# Altium project Ultrasound Smart Probe_Ver2.PrjPcb (part 4 of 9)

## Sheet LVPS_FX3_Supply.SchDoc: FX3 Power Supply
size 431 x 279 mm; Date: Not shown in title block; ApprovedBy: Not shown in title block; CheckedBy: Not shown in title block; Author: Not shown in title block; CompanyName: Not shown in title block; DrawnBy: Abhishek Vishwa; Engineer: Not shown in title block; Organization: Not shown in title block; Address1: Not shown in title block; Address2: Not shown in title block; Address3: Not shown in title block; Address4: Not shown in title block; DocumentNumber: 1; Revision: Use project parameter SCH_Rev; SheetNumber: 4; SheetTotal: 12; PageSetup: Record=PageOptions|CenterHorizontal=True|CenterVertical=True|PrintScale=1.00|XCorrection=1.00|YCorrection=1.00|PrintKind=0|BorderSize=5000000|LeftOffset=0|BottomOffset=0|Orientation=2|PaperLength=1000|PaperWidth=1000|Scale=100|PaperSource=15|PrintQuality=600|MediaType=1|DitherType=10|PaperKind=Letter|PrintScaleMode=1; CurrentTime: Not shown in title block; CurrentDate: Not shown in title block; Time: Not shown in title block; DocumentFullPathAndName: Not shown in title block; DocumentName: Not shown in title block; ModifiedDate: Not shown in title block; ImagePath: Not shown in title block
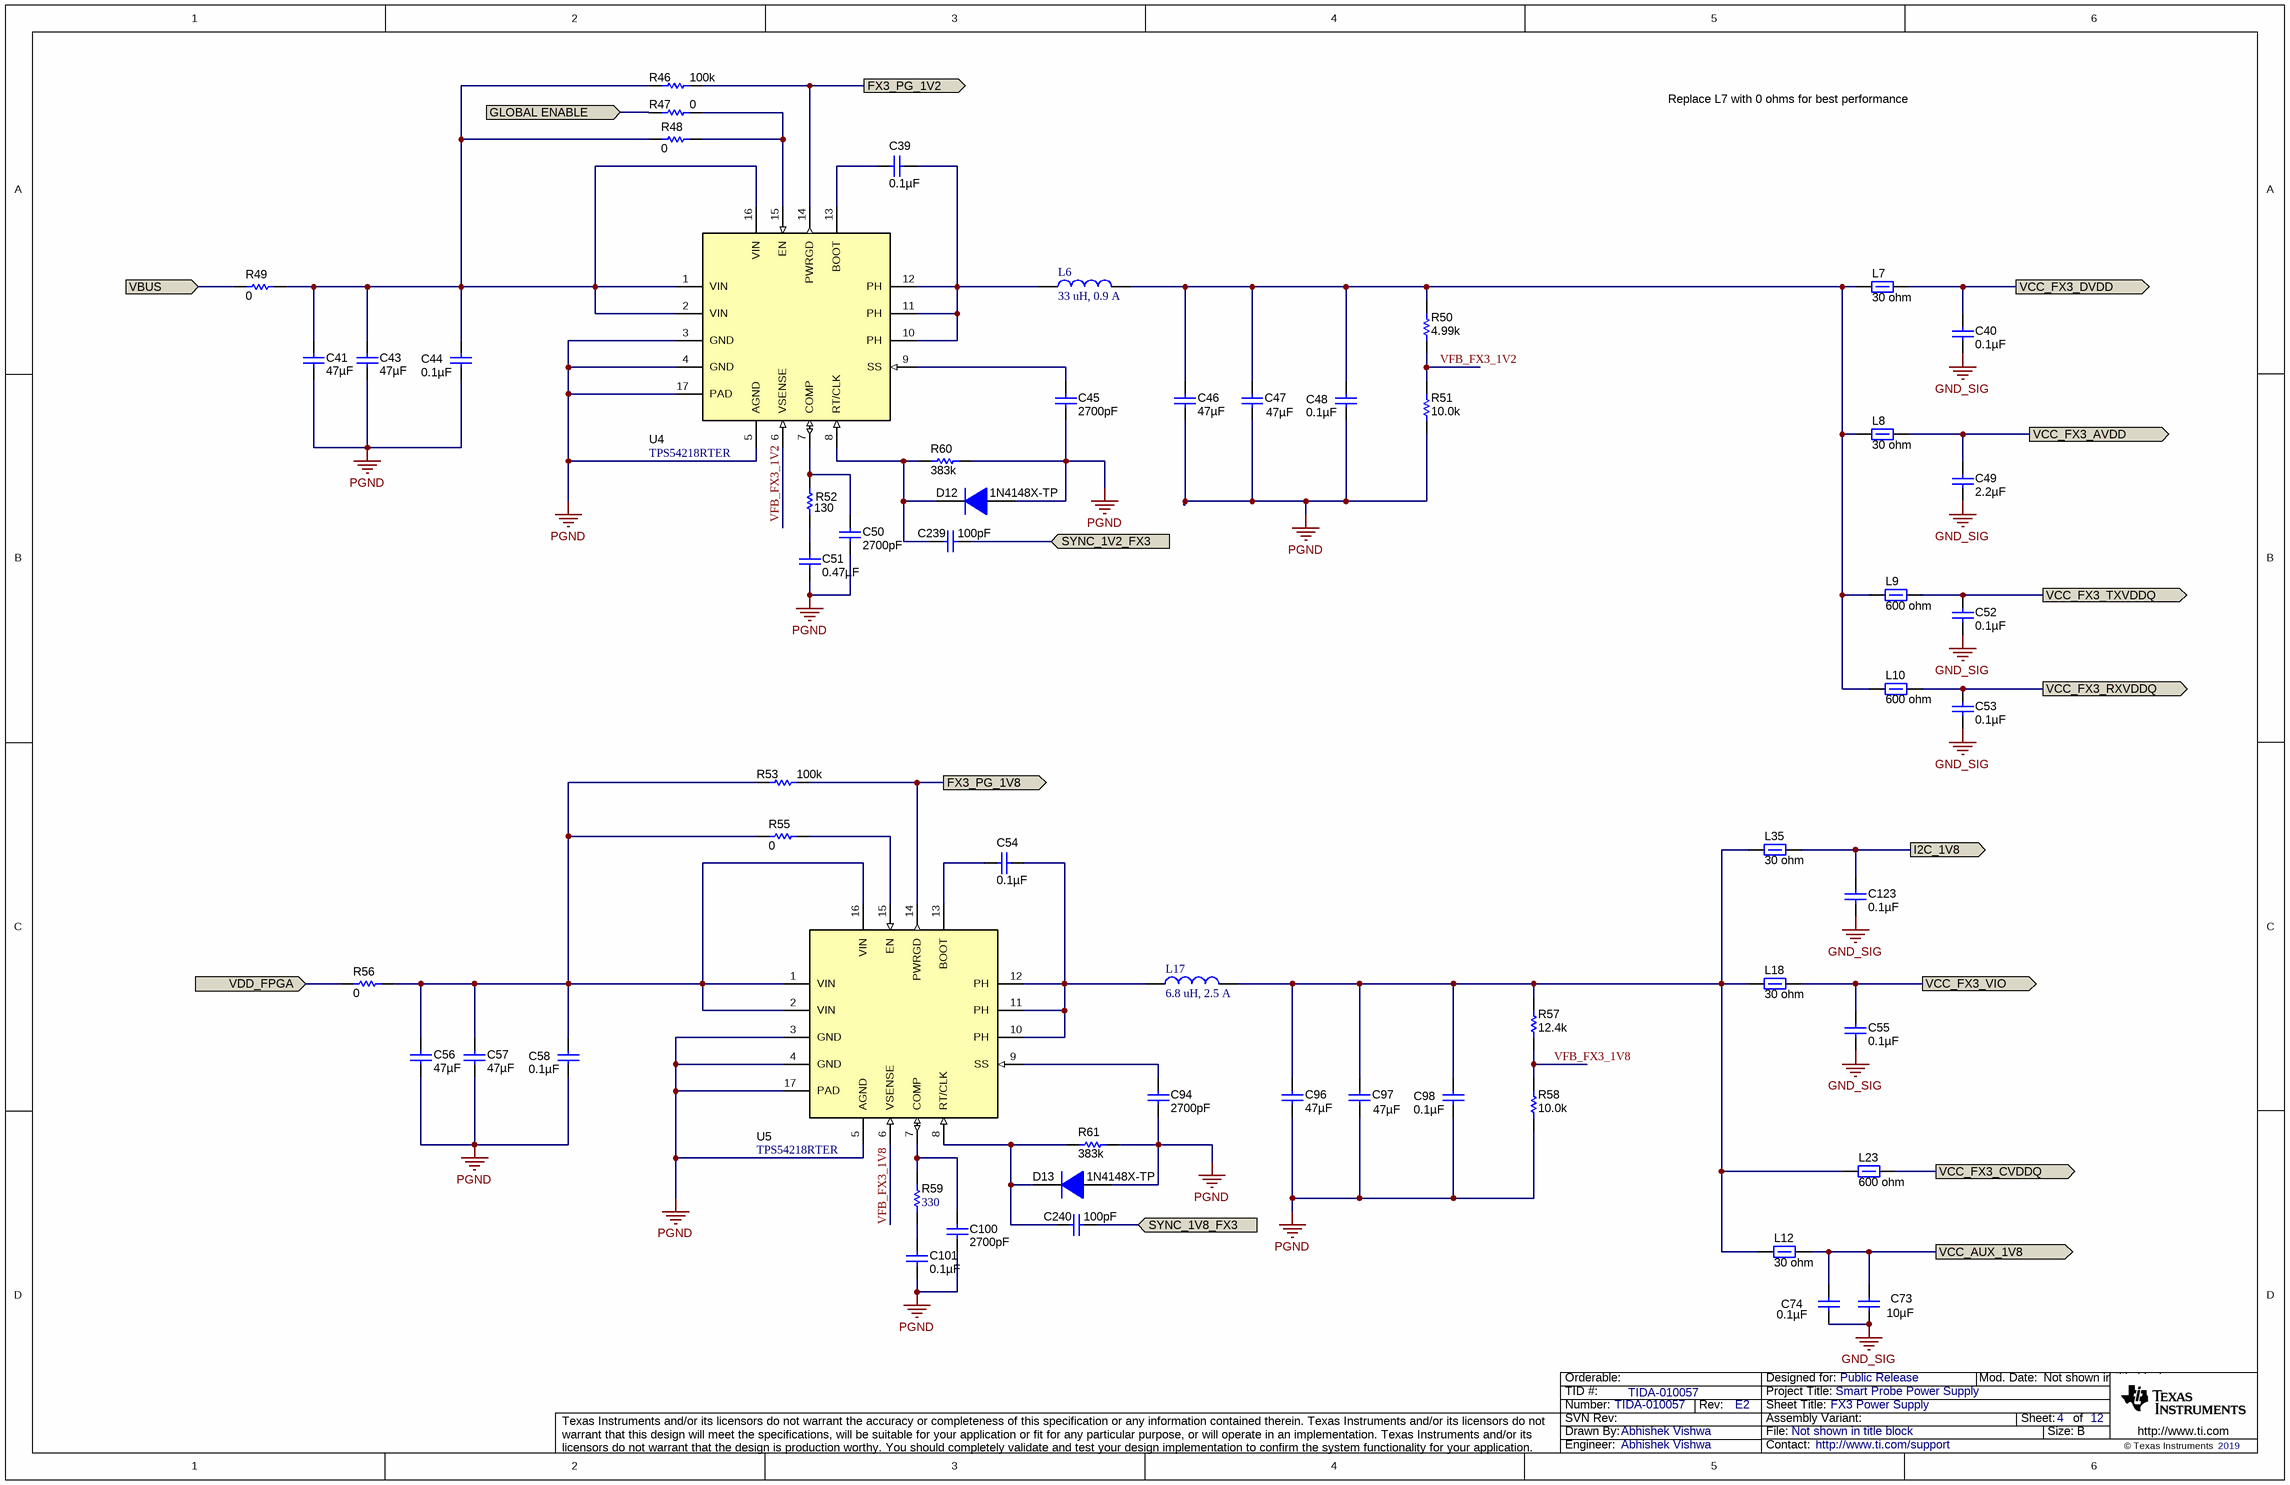
[diagram p3: LVPS_FX3_Supply.SchDoc]

### Parts
C39  ValueDisplayed: 0.1µF  [0603]  (hidden comment: 885012206095)
C40  ValueDisplayed: 0.1µF  [0402]  (hidden comment: GRM155R61E104KA87D)
C41  ValueDisplayed: 47µF  [0805_HV]  (hidden comment: GRM219R60J476ME44D)
C43  ValueDisplayed: 47µF  [0805_HV]  (hidden comment: GRM219R60J476ME44D)
C44  ValueDisplayed: 0.1µF  [0603]  (hidden comment: 885012206095)
C45  ValueDisplayed: 2700pF  [0402]  (hidden comment: CL05B272KB5NNNC)
C46  ValueDisplayed: 47µF  [0603]  (hidden comment: GRM188R60J476ME15D)
C47  ValueDisplayed: 47µF  [0603]  (hidden comment: GRM188R60J476ME15D)
C48  ValueDisplayed: 0.1µF  [0603]  (hidden comment: 885012206095)
C49  ValueDisplayed: 2.2µF  [0402_070]  (hidden comment: CL05A225MA5NUNC)
C50  ValueDisplayed: 2700pF  [0402]  (hidden comment: CL05B272KB5NNNC)
C51  ValueDisplayed: 0.47µF  [0402]  (hidden comment: CL05A474KP5NNNC)
C52  ValueDisplayed: 0.1µF  [0402]  (hidden comment: GRM155R61E104KA87D)
C53  ValueDisplayed: 0.1µF  [0402]  (hidden comment: GRM155R61E104KA87D)
C54  ValueDisplayed: 0.1µF  [0603]  (hidden comment: 885012206095)
C55  ValueDisplayed: 0.1µF  [0402]  (hidden comment: GRM155R61E104KA87D)
C56  ValueDisplayed: 47µF  [0805_HV]  (hidden comment: GRM219R60J476ME44D)
C57  ValueDisplayed: 47µF  [0805_HV]  (hidden comment: GRM219R60J476ME44D)
C58  ValueDisplayed: 0.1µF  [0603]  (hidden comment: 885012206095)
C73  ValueDisplayed: 10µF  [0402]  (hidden comment: CL05A106MP5NUNC)
C74  ValueDisplayed: 0.1µF  [0402]  (hidden comment: GRM155R61E104KA87D)
C94  ValueDisplayed: 2700pF  [0402]  (hidden comment: CL05B272KB5NNNC)
C96  ValueDisplayed: 47µF  [0603]  (hidden comment: GRM188R60J476ME15D)
C97  ValueDisplayed: 47µF  [0603]  (hidden comment: GRM188R60J476ME15D)
C98  ValueDisplayed: 0.1µF  [0603]  (hidden comment: 885012206095)
C100  ValueDisplayed: 2700pF  [0402]  (hidden comment: CL05B272KB5NNNC)
C101  ValueDisplayed: 0.1µF  [0402]  (hidden comment: GRM155R61E104KA87D)
C123  ValueDisplayed: 0.1µF  [0402]  (hidden comment: GRM155R61E104KA87D)
C239  ValueDisplayed: 100pF  [0402]  (hidden comment: CL05C101JB5NNNC)
C240  ValueDisplayed: 100pF  [0402]  (hidden comment: CL05C101JB5NNNC)
D12  1N4148X-TP  [SOD-523]
D13  1N4148X-TP  [SOD-523]
L6  33 uH, 0.9 A  [WE-TPC_5828]
L7  ValueDisplayed: 30 ohm  [0603]  (hidden comment: 742792609)
L8  ValueDisplayed: 30 ohm  [0603]  (hidden comment: 742792609)
L9  ValueDisplayed: 600 ohm  [0603]  (hidden comment: 782633601)
L10  ValueDisplayed: 600 ohm  [0603]  (hidden comment: 782633601)
L12  ValueDisplayed: 30 ohm  [0603]  (hidden comment: 742792609)
L17  6.8 uH, 2.5 A  [WE-LQS_5040]
L18  ValueDisplayed: 30 ohm  [0603]  (hidden comment: 742792609)
L23  ValueDisplayed: 600 ohm  [0603]  (hidden comment: 782633601)
L35  ValueDisplayed: 30 ohm  [0603]  (hidden comment: 742792609)
R46  ValueDisplayed: 100k  [0402]  (hidden comment: CRCW0402100KJNED)
R47  ValueDisplayed: 0  [0402]  (hidden comment: ERJ-2GE0R00X)
R48  ValueDisplayed: 0  [0402]  (hidden comment: ERJ-2GE0R00X)
R49  ValueDisplayed: 0  [0603]  (hidden comment: RMCF0603ZT0R00)
R50  ValueDisplayed: 4.99k  [0402]  (hidden comment: ERJ-2RKF4991X)
R51  ValueDisplayed: 10.0k  [0402]  (hidden comment: ERA-2AEB103X)
R52  ValueDisplayed: 130  [0402]  (hidden comment: CRCW0402130RJNED)
R53  ValueDisplayed: 100k  [0402]  (hidden comment: CRCW0402100KJNED)
R55  ValueDisplayed: 0  [0402]  (hidden comment: ERJ-2GE0R00X)
R56  ValueDisplayed: 0  [0603]  (hidden comment: RMCF0603ZT0R00)
R57  ValueDisplayed: 12.4k  [0402]  (hidden comment: CRCW040212K4FKED)
R58  ValueDisplayed: 10.0k  [0402]  (hidden comment: ERA-2AEB103X)
R59  ValueDisplayed: 330  [0402]  (hidden comment: CRCW0402160RJNED)
R60  ValueDisplayed: 383k  [0402]  (hidden comment: CRCW0402383KFKED)
R61  ValueDisplayed: 383k  [0402]  (hidden comment: CRCW0402383KFKED)
U4  TPS54218RTER  [RTE0016F]
U5  TPS54218RTER  [RTE0016F]

### Ports
FX3_PG_1V2 (out), FX3_PG_1V8 (out), GLOBAL ENABLE (in), I2C_1V8 (out), SYNC_1V2_FX3 (in), SYNC_1V8_FX3 (in), VBUS (in), VCC_AUX_1V8 (out), VCC_FX3_AVDD (out), VCC_FX3_CVDDQ (out), VCC_FX3_DVDD (out), VCC_FX3_RXVDDQ (out), VCC_FX3_TXVDDQ (out), VCC_FX3_VIO (out), VDD_FPGA (in)

### Nets
GND_SIG: C40.1 C49.2 C52.1 C53.1 C55.1 C73.2 C74.1 C123.1
PGND: C41.2 C43.2 C44.2 C45.2 C46.2 C47.2 C48.2 C50.2 C51.1 C56.2 C57.2 C58.2 C94.2 C96.2 C97.2 C98.2 C100.2 C101.2 D12.2(A) D13.2(A) R51.1 R58.1 R60.2 R61.2 U4.3(GND) U4.4(GND) U4.5(AGND) U4.17(PAD) U5.3(GND) U5.4(GND) U5.5(AGND) U5.17(PAD)
FX3_PG_1V2: R46.2 U4.14(PWRGD) ; port FX3_PG_1V2
FX3_PG_1V8: R53.2 U5.14(PWRGD) ; port FX3_PG_1V8
GLOBAL ENABLE: R47.1 ; port GLOBAL ENABLE
I2C_1V8: C123.2 L35.2 ; port I2C_1V8
SYNC_1V2_FX3: C239.1 ; port SYNC_1V2_FX3
SYNC_1V8_FX3: C240.1 ; port SYNC_1V8_FX3
VBUS: R49.2 ; port VBUS
VCC_AUX_1V8: C73.1 C74.2 L12.2 ; port VCC_AUX_1V8
VCC_FX3_AVDD: C49.1 L8.2 ; port VCC_FX3_AVDD
VCC_FX3_CVDDQ: L23.2 ; port VCC_FX3_CVDDQ
VCC_FX3_DVDD: C40.2 L7.2 ; port VCC_FX3_DVDD
VCC_FX3_RXVDDQ: C53.2 L10.2 ; port VCC_FX3_RXVDDQ
VCC_FX3_TXVDDQ: C52.2 L9.2 ; port VCC_FX3_TXVDDQ
VCC_FX3_VIO: C55.2 L18.2 ; port VCC_FX3_VIO
VDD_FPGA: R56.2 ; port VDD_FPGA
VFB_FX3_1V2: R50.1 R51.2 U4.6(VSENSE)
VFB_FX3_1V8: R57.1 R58.2 U5.6(VSENSE)
NetC39_1: C39.1 U4.13(BOOT)
NetC39_2: C39.2 L6.1 U4.10(PH) U4.11(PH) U4.12(PH)
NetC41_1: C41.1 C43.1 C44.1 R46.1 R48.1 R49.1 U4.1(VIN) U4.2(VIN) U4.16(VIN)
NetC45_1: C45.1 U4.9(SS)
NetC46_1: C46.1 C47.1 C48.1 L6.2 L7.1 L8.1 L9.1 L10.1 R50.2
NetC50_1: C50.1 R52.2 U4.7(COMP)
NetC51_2: C51.2 R52.1
NetC54_1: C54.1 U5.13(BOOT)
NetC54_2: C54.2 L17.1 U5.10(PH) U5.11(PH) U5.12(PH)
NetC56_1: C56.1 C57.1 C58.1 R53.1 R55.1 R56.1 U5.1(VIN) U5.2(VIN) U5.16(VIN)
NetC94_1: C94.1 U5.9(SS)
NetC96_1: C96.1 C97.1 C98.1 L12.1 L17.2 L18.1 L23.1 L35.1 R57.2
NetC100_1: C100.1 R59.2 U5.7(COMP)
NetC101_1: C101.1 R59.1
NetC239_2: C239.2 D12.1(K) R60.1 U4.8(RT/CLK)
NetC240_2: C240.2 D13.1(K) R61.1 U5.8(RT/CLK)
NetR47_2: R47.2 R48.2 U4.15(EN)
NetR55_2: R55.2 U5.15(EN)

### Notes on the sheet
- Replace L7 with 0 ohms for best performance
- Drawn By:
- SVN Rev:
- Number:
- TID #:
- Orderable:
- Rev:
- Sheet Title:
- File:
- Project Title:
- Designed for:
- Assembly Variant:
- Mod. Date:
- Sheet:
- Size:
- of
- B
- http://www.ti.com
- Texas Instruments and/or its licensors do not warrant the accuracy or completeness of this specification or any information contained therein. Texas Instruments and/or its licensors do not warrant that this design will meet the specifications, will be suitable for your application or fit for any particular purpose, or will operate in an implementation. Texas Instruments and/or its licensors do not warrant that the design is production worthy. You should completely validate and test your design implementation to confirm the system functionality for your application.
- Engineer:
- Contact:
- © Texas Instruments

### Library data of the parts
C39 C44 C48 C54 C58 C98 = 885012206095: CAP, CERM, 0.1 µF, 50 V,+/- 10%, X7R, 0603; Manufacturer: Wurth Elektronik; Polarized: N; CompType: Capacitor; Value: 0.1uF; U/M: EA; Cap_F: 0.0000001; Tolerance_%: 10; VDC_V: 50; Value2: 50V; TaMin_C: -55; TaMax_C: 125; SizeArea_mm2: 1.28; SizeAreaWB_mm2: 4.68; SizeX_mm: 1.6; SizeY_mm: 0.8; SizeZ_mm: 1; AEC Category: Q200; Green_Lifecycle: Active; Green_REACh: Passed; SymbolVersion: 2008-07-09; PartNumber: 885012206095; PackageReference: 0603; RoHS: Y; MountType: SMT; Technology: Ceramic; TempCo: X7R; Cap_Case: 0603; Published: 2008-06-19; Publisher: Texas Instruments; LatestRevisionDate: 2017-06-22; ComponentLink1Description: Datasheet link; ComponentLink1URL: http://katalog.we-online.de/pbs/datasheet/885012206095.pdf; AEC Qualified: N; AEC Grade: N/A; Green_EU RoHS: Passed; Green_EU RoHS-2: Incomplete
C40 C52 C53 C55 C74 C101 C123 = GRM155R61E104KA87D: as C165-C170 on sheet Input Output Connector; SymbolVersion: 2008-07-09; PartNumber: GRM155R61E104KA87D; PackageReference: 0402; RoHS: Y; MountType: SMT; Technology: Ceramic; TempCo: X5R; Cap_Case: 0402; SizeY_mm: 0.5; Published: 2008-06-19; Publisher: Texas Instruments; LatestRevisionDate: 2017-06-22; ComponentLink1Description: Datasheet link; ComponentLink1URL: http://psearch.murata.com/capacitor/product/GRM155R61E104KA87%23.pdf; Supplier 1: Digi-Key; Supplier Part Number 1: 490-5920-1-ND; Supplier 2: Mouser; Supplier Part Number 2: 81-GRM155R61E104KA7D; AEC Qualified: N; AEC Grade: N/A; Green_EU RoHS: Passed; Green_EU RoHS-2: Passed
C41 C43 C56 C57 = GRM219R60J476ME44D: CAP, CERM, 47 µF, 6.3 V,+/- 20%, X5R, 0805; Manufacturer: MuRata; Polarized: N; CompType: Capacitor; Value: 47uF; U/M: EA; Cap_F: 0.000047; Tolerance_%: 20; VDC_V: 6.3; Value2: 6.3V; TaMin_C: -55; TaMax_C: 85; Cap_Case: 0805; SizeArea_mm2: 2.5; SizeAreaWB_mm2: 6.75; SizeX_mm: 2; SizeY_mm: 1.25; SizeZ_mm: 1.45; AEC Category: Q200; Green_Lifecycle: Active; Green_REACh: Passed; SymbolVersion: 2008-07-09; PartNumber: GRM219R60J476ME44D; PackageReference: 0805; RoHS: Y; MountType: SMT; Technology: Ceramic; TempCo: X5R; Published: 2008-06-19; Publisher: Texas Instruments; LatestRevisionDate: 2017-06-22; ComponentLink1Description: Datasheet link; ComponentLink1URL: http://psearch.en.murata.com/capacitor/product/GRM219R60J476ME44%23.pdf; Supplier 1: Digi-Key; Supplier Part Number 1: 490-13249-1-ND; Supplier 2: Mouser; Supplier Part Number 2: 81-GRM219R60J476ME4D; AEC Qualified: N; AEC Grade: N/A; Green_EU RoHS: Passed; Green_EU RoHS-2: Incomplete
C45 C50 C94 C100 = GRM155R71H272KA01D: CAP, CERM, 2700 pF, 50 V,+/- 10%, X7R, 0402; Manufacturer: Samsung Electro-Mechanics; Polarized: N; CompType: Capacitor; Value: 2700pF; U/M: EA; Cap_F: 0.0000000027; Tolerance_%: 10; VDC_V: 50; Value2: 50V; TaMin_C: -55; TaMax_C: 125; SizeArea_mm2: 0.5; SizeAreaWB_mm2: 3; SizeX_mm: 1; SizeZ_mm: 0.6; AEC Category: Q200; SymbolVersion: 2008-07-09; PartNumber: CL05B272KB5NNNC; PackageReference: 0402; RoHS: Y; MountType: SMT; Technology: Ceramic; TempCo: X7R; Cap_Case: 0402; SizeY_mm: 0.5; Published: 2008-06-19; Publisher: Texas Instruments; LatestRevisionDate: 2017-06-22; ComponentLink1Description: Datasheet link; ComponentLink1URL: http://search.murata.co.jp/Ceramy/PnsearchViewAction.do?HnOFG=ON&HnNFG=ON&SEL_CNT=50&sLang=en&sKey=GRM155R71H272KA01D&x=9&y=9&search=startwith; Supplier 1: Digi-Key; Supplier Part Number 1: 1276-1268-1-ND; Supplier 2: Mouser; AEC Qualified: ?
C46 C47 C96 C97 = GRM188R60J476ME15D: CAP, CERM, 47 µF, 6.3 V,+/- 20%, X5R, 0603; Manufacturer: MuRata; Polarized: N; CompType: Capacitor; Value: 47uF; U/M: EA; Cap_F: 0.000047; Tolerance_%: 20; VDC_V: 6.3; Value2: 6.3V; TaMin_C: -55; TaMax_C: 85; SizeArea_mm2: 1.28; SizeAreaWB_mm2: 4.68; SizeX_mm: 1.6; SizeY_mm: 0.8; SizeZ_mm: 1; AEC Category: Q200; Green_Lifecycle: Active; Green_REACh: Passed; SymbolVersion: 2008-07-09; PartNumber: GRM188R60J476ME15D; PackageReference: 0603; RoHS: Y; MountType: SMT; Technology: Ceramic; TempCo: X5R; Cap_Case: 0603; Published: 2008-06-19; Publisher: Texas Instruments; LatestRevisionDate: 2017-06-22; ComponentLink1Description: Datasheet link; ComponentLink1URL: http://psearch.en.murata.com/capacitor/product/GRM188R60J476ME15%23.pdf; AEC Qualified: ?; Green_EU RoHS: Passed; Green_EU RoHS-2: Incomplete
C49 = GRM155R6YA225ME11D: CAP, CERM, 2.2 µF, 25 V,+/- 20%, X5R, 0402; Manufacturer: Samsung Electro-Mechanics; Polarized: N; CompType: Capacitor; Value: 2.2uF; U/M: EA; Cap_F: 0.0000022; Tolerance_%: 20; VDC_V: 35; Value2: 25V; TaMin_C: -55; TaMax_C: 85; Cap_Case: 0402; SizeArea_mm2: 0.5; SizeAreaWB_mm2: 3; SizeX_mm: 1; SizeZ_mm: 0.7; AEC Category: Q200; SymbolVersion: 2008-07-09; PartNumber: CL05A225MA5NUNC; PackageReference: 0402; RoHS: Y; MountType: SMT; Technology: Ceramic; TempCo: X5R; SizeY_mm: 0.5; Published: 2008-06-19; Publisher: Texas Instruments; LatestRevisionDate: 2017-06-22; ComponentLink1Description: Datasheet link; ComponentLink1URL: https://sps06.itg.ti.com/sites/KMS/crossdivteams/altium/docs/ComponentDatasheets/GRM155R6YA225ME11_0402_X5R_2p2uF_35V_CF_special.pdf; Supplier 1: Digi-Key; Supplier Part Number 1: 1276-1465-1-ND; AEC Qualified: ?
C51 = GRM155R61E104KA87D: CAP CER 0.47UF 10V X5R 0402; Manufacturer: Samsung Electro-Mechanics; Polarized: N; CompType: Capacitor; U/M: EA; Cap_F: 0.0000001; Tolerance_%: 10; VDC_V: 25; Value2: 25V; TaMin_C: -55; TaMax_C: 85; SizeArea_mm2: 0.5; SizeAreaWB_mm2: 3; SizeX_mm: 1; SizeZ_mm: 0.6; AEC Category: Q200; Green_Lifecycle: Active; Green_REACh: Passed; SymbolVersion: 2008-07-09; Value: 0.47uF; PartNumber: CL05A474KP5NNNC; PackageReference: 0402; RoHS: Y; MountType: SMT; Technology: Ceramic; TempCo: X5R; Cap_Case: 0402; SizeY_mm: 0.5; Published: 2008-06-19; Publisher: Texas Instruments; LatestRevisionDate: 2017-06-22; ComponentLink1Description: Datasheet link; ComponentLink1URL: http://psearch.murata.com/capacitor/product/GRM155R61E104KA87%23.pdf; AEC Qualified: N; AEC Grade: N/A; Green_EU RoHS: Passed; Green_EU RoHS-2: Passed
C73 = CL05A106MP5NUNC: CAP, CERM, 10 µF, 10 V,+/- 20%, X5R, 0402; Manufacturer: Samsung Electro-Mechanics; Polarized: N; CompType: Capacitor; Value: 10uF; U/M: EA; Cap_F: 0.00001; Tolerance_%: 20; VDC_V: 10; Value2: 10V; TaMin_C: -55; TaMax_C: 85; SizeArea_mm2: 0.5; SizeAreaWB_mm2: 3; SizeX_mm: 1; SizeZ_mm: 0.6; AEC Category: Q200; Green_Lifecycle: Active; Green_REACh: Passed; SymbolVersion: 2008-07-09; PartNumber: CL05A106MP5NUNC; PackageReference: 0402; RoHS: Y; MountType: SMT; Technology: Ceramic; TempCo: X5R; Cap_Case: 0402; SizeY_mm: 0.5; Published: 2008-06-19; Publisher: Texas Instruments; LatestRevisionDate: 2017-06-22; ComponentLink1Description: Datasheet link; ComponentLink1URL: https://sps06.itg.ti.com/sites/KMS/crossdivteams/altium/docs/ComponentDatasheets/CL05A106MP5NUNC.pdf; Supplier 1: Digi-Key; Supplier Part Number 1: 1276-1450-1-ND; AEC Qualified: ?; Green_EU RoHS: Passed; Green_EU RoHS-2: Incomplete
C239 C240 = 0402YC101KAT2A: CAP CER 100PF 50V C0G/NP0 0402; Manufacturer: Samsung Electro-Mechanics; Polarized: N; CompType: Capacitor; U/M: EA; Cap_F: 0.0000000001; Tolerance_%: 5; VDC_V: 16; Value2: 50; TempCo: X7R; TaMin_C: -55; TaMax_C: 125; SizeArea_mm2: 0.5; SizeAreaWB_mm2: 3; SizeX_mm: 1; SizeZ_mm: 0.6; AEC Category: Q200; SymbolVersion: 2008-07-09; Value: 100pF; PartNumber: CL05C101JB5NNNC; PackageReference: 0402; RoHS: Y; MountType: SMT; Technology: Ceramic; Cap_Case: 0402; SizeY_mm: 0.5; Published: 2008-06-19; Publisher: Texas Instruments; LatestRevisionDate: 2017-06-22; ComponentLink1Description: Datasheet link; ComponentLink1URL: http://datasheets.avx.com/X7RDielectric.pdf; Supplier 1: Digi-Key; Supplier Part Number 1: 1276-1025-1-ND; Supplier 2: Newark; Supplier 3: Mouser; AEC Qualified: N; AEC Grade: N/A
D12 D13 = 1N4148X-TP: Diode, Switching, 75 V, 0.3 A, SOD-523; Manufacturer: Micro Commercial Components; U/M: EA; Vf_V: 1.25; Value: 75V; Value1: 0.3A; Value2: 1.25V; Io_A: 0.3; Vr_V: 75; TJmax_C: 150; SizeAreaWB_mm2: 5.13; SizeArea_mm2: 1.53; SizeX_mm: 1.7; SizeY_mm: 0.9; SizeZ_mm: 0.65; AEC Category: Q101; Green_Lifecycle: Not Set; Green_REACh: Incomplete; SymbolVersion: 2008-12-08; PartNumber: 1N4148X-TP; PackageReference: SOD-523; CompType: Diode; MountType: SMT; Type: Switching; RoHS: Y; Published: 2008-06-26; Publisher: Texas Instruments; LatestRevisionDate: 2017-06-26; ComponentLink1Description: Datasheet link; ComponentLink1URL: http://www.mccsemi.com/up_pdf/1N4148X(SOD-523).PDF; Supplier 1: Digi-Key; Supplier Part Number 1: 1N4148XTPMSCT-ND; Supplier 2: Newark; Supplier Part Number 2: 69R6666; Supplier 3: Mouser; Supplier Part Number 3: 833-1N4148X-TP; AEC Qualified: ?; Green_EU RoHS: Incomplete; Green_EU RoHS-2: Incomplete
L6 = 744053330: SMT Shielded Tiny Power Inductor WE-TPC, size 5828, 33 uH, 0.9 A; Rated Current: 0.9 A; Inductance: 33 uH; DC Resistance max.: 190 mOhm; Self Resonant Frequency: 15 MHz; Saturation Current: 0.75 A; ComponentLink1Description: Manufacturer; ComponentLink1URL: http://www.we-online.de; ComponentLink2Description: Datasheet; ComponentLink2URL: https://katalog.we-online.com/pbs/datasheet/744053330.pdf; Part Number: 744053330; Published Date: December 2018; Publisher: Wurth Elektronik; Size: 5828; Operating Temperature: -40 to +125 degC; Mounting Technology: SMT; Packaging: Tape and Reel
L7 L8 L12 L18 L35 = 742792609: as L32 on sheet Input Output Connector; SymbolVersion: 2017-01-06; PartNumber: 742792609; CompType: Ferrite Bead; MountType: SMT; PackageReference: 0603; Published: 2014-04-30; Publisher: Texas Instruments; LatestRevisionDate: 2017-06-22; ComponentLink1Description: Datasheet link; ComponentLink1URL: http://katalog.we-online.de/pbs/datasheet/742792609.pdf; RoHS: Y; Supplier 1: Digi-Key; Supplier Part Number 1: 732-1591-1-ND; Supplier 2: Mouser; Supplier Part Number 2: 710-742792609; Green_EU RoHS: Passed; Green_EU RoHS-2: Incomplete
L9 L10 L23 = 782633601: Ferrite Bead, 600 ohm @ 100 MHz, 1 A, 0603; Manufacturer: Wurth Elektronik; Value: 600 ohm; Imax_A: 1; DCR_ohm: 0.2; Value1: 0.2 ohm; Value2: 1A; SizeAreaWB_mm2: 4.68; SizeArea_mm2: 1.28; SizeX_mm: 1.6; SizeY_mm: 0.8; ZTyp@100MHz_Ohm: 600; Ztyp@1GHz_Ohm: 228.849; Green_Lifecycle: Active; Green_REACh: Passed; SymbolVersion: 2017-01-06; PartNumber: 782633601; CompType: Ferrite Bead; MountType: SMT; PackageReference: 0603; SizeZ_mm: 1; Published: 2014-04-30; Publisher: Texas Instruments; LatestRevisionDate: 2017-06-22; ComponentLink1Description: Datasheet link; ComponentLink1URL: http://katalog.we-online.de/pbs/datasheet/782633601.pdf; RoHS: Y; Supplier 1: Digi-Key; Supplier Part Number 1: 732-6703-1-ND; Green_EU RoHS: Passed; Green_EU RoHS-2: Incomplete
L17 = 74404054068: SMT Semi-Shielded Power Inductor WE-LQS, size 5040, 6.8 uH, 2.5 A; Rated Current: 2.5 A; Inductance: 6.8 uH; DC Resistance max.: 51.6 mOhm; Self Resonant Frequency: 35 MHz; Saturation Current: 3.2 A; ComponentLink1Description: Manufacturer; ComponentLink1URL: http://www.we-online.de; ComponentLink2Description: Datasheet; ComponentLink2URL: https://katalog.we-online.de/pbs/datasheet/74404054068.pdf; Part Number: 74404054068; Published Date: November 2018; Publisher: Wurth Elektronik; Size: 5040; Operating Temperature: -40 to +125 degC; Mounting Technology: SMT; Packaging: Tape and Reel
R46 R53 = CRCW0402100KJNED: RES, 100 k, 5%, 0.063 W, 0402; Manufacturer: Vishay-Dale; CompType: Resistor; Value: 100k; Res_ohm: 100000; Tolerance_%: 5; Power_W: 0.063; Value2: 0.063W; VDC_V: 50; TempCo: 200 ppm/C; SizeArea_mm2: 0.5; SizeX_mm: 1; SizeZ_mm: 0.6; EIA_Code: E24; U/M: EA; AEC Category: Q200; Green_Lifecycle: Active; Green_REACh: Passed; SymbolVersion: 2009-05-29; PartNumber: CRCW0402100KJNED; PackageReference: 0402; RoHS: Y; Value_Code: 100k; Value1: 5%; MountType: SMT; Technology: Thick Film; SizeY_mm: 0.5; Published: 2008-06-26; Publisher: Texas Instruments; LatestRevisionDate: 2017-06-12; ComponentLink1Description: Datasheet link; ComponentLink1URL: http://www.vishay.com/docs/20035/dcrcwe3.pdf; Supplier 1: Digi-Key; Supplier Part Number 1: 541-100KJCT-ND; Supplier 2: Newark; Supplier Part Number 2: 59M6699; Supplier 3: Mouser; Supplier Part Number 3: 71-CRCW0402J-100K-E3; AEC Qualified: ?; Green_EU RoHS: Passed with Exemption; Green_EU RoHS-2: Passed
R47 R48 R55 = ERJ-2GE0R00X: as R25 on sheet Input Output Connector; SymbolVersion: 2009-05-29; PartNumber: ERJ-2GE0R00X; PackageReference: 0402; RoHS: Y; Res_ohm: 0; Value1: 5%; MountType: SMT; Technology: Thick Film; SizeY_mm: 0.5; Published: 2008-06-26; Publisher: Texas Instruments; LatestRevisionDate: 2017-06-12; ComponentLink1Description: Datasheet link; ComponentLink1URL: http://www.panasonic.com/industrial/components/pdf/AOA0000CE1.pdf; Supplier 1: Digi-Key; Supplier Part Number 1: P0.0JCT-ND; Supplier 2: Newark; Supplier Part Number 2: 65T8307; Supplier 3: Mouser; Supplier Part Number 3: 667-ERJ-2GE0R00X; AEC Qualified: ?; Green_EU RoHS: Passed with Exemption; Green_EU RoHS-2: Passed
R49 R56 = RMCF0603ZT0R00: RES, 0, 1%, 0.1 W, AEC-Q200 Grade 0, 0603; Manufacturer: Stackpole Electronics Inc; CompType: Resistor; Value: 0; Tolerance_%: 1; Power_W: 0.1; Value2: 0.1W; TempCo: ppm/C; SizeArea_mm2: 1.28; SizeX_mm: 1.6; SizeY_mm: 0.8; U/M: EA; AEC Category: Q200; AEC Qualified: Y; Green_Lifecycle: Active; Green_REACh: Passed; SymbolVersion: 2009-05-29; PartNumber: RMCF0603ZT0R00; PackageReference: 0603; RoHS: Y; Res_ohm: 0; Value_Code: 0; Value1: 1%; MountType: SMT; Technology: Thick Film; SizeZ_mm: 1; Published: 2008-06-26; Publisher: Texas Instruments; LatestRevisionDate: 2017-06-13; ComponentLink1Description: Datasheet link; ComponentLink1URL: https://www.seielect.com/Catalog/SEI-RMCF_RMCP.pdf; Supplier 1: Digi-Key; Supplier Part Number 1: RMCF0603ZT0R00CT-ND; AEC Grade: 0; Green_EU RoHS: Passed with Exemption; Green_EU RoHS-2: Incomplete
R50 = ERJ-2RKF4991X: RES, 4.99 k, 1%, 0.1 W, AEC-Q200 Grade 0, 0402; Manufacturer: Panasonic; CompType: Resistor; Value: 4.99k; Res_ohm: 4990; Value_Code: 4k99; Tolerance_%: 1; Power_W: 0.1; Value2: 0.1W; VDC_V: 50; TempCo: 100 ppm/C; SizeArea_mm2: 0.5; SizeZ_mm: 0.6; EIA_Code: E96; U/M: EA; AEC Category: Q200; AEC Qualified: Y; AEC Grade: 0; Green_Lifecycle: Active; Green_REACh: Passed; SymbolVersion: 2009-05-29; PartNumber: ERJ-2RKF4991X; PackageReference: 0402; RoHS: Y; Value1: 1%; MountType: SMT; Technology: Thick Film; SizeX_mm: 1; SizeY_mm: 0.5; Published: 2008-06-26; Publisher: Texas Instruments; LatestRevisionDate: 2017-06-12; ComponentLink1Description: Datasheet link; ComponentLink1URL: http://industrial.panasonic.com/cdbs/www-data/pdf/RDA0000/AOA0000C86.pdf; Supplier 1: Digi-Key; Supplier Part Number 1: P4.99KLCT-ND; Supplier 2: Newark; Supplier Part Number 2: 73T6529; Supplier 3: Mouser; Supplier Part Number 3: 667-ERJ-2RKF4991X; Green_EU RoHS: Passed with Exemption; Green_EU RoHS-2: Passed
R51 R58 = RK73H1ETTP1002F: RES SMD 10K OHM 0.1% 1/16W 0402; Manufacturer: Panasonic Electronic Components; CompType: Resistor; Value: 10.0k; Res_ohm: 10000; Value_Code: 10k0; Tolerance_%: 1; Power_W: 0.063; Value2: 0.063W; VDC_V: 50; TempCo: 100 ppm/C; SizeArea_mm2: 0.5; SizeZ_mm: 0.6; EIA_Code: E96; U/M: EA; AEC Category: Q200; AEC Qualified: Y; AEC Grade: 0; SymbolVersion: 2009-05-29; PartNumber: ERA-2AEB103X; PackageReference: 0402; RoHS: Y; Value1: 0.1%; MountType: SMT; Technology: Thick Film; SizeX_mm: 1; SizeY_mm: 0.5; Published: 2008-06-26; Publisher: Texas Instruments; LatestRevisionDate: 2017-06-12; ComponentLink1Description: Datasheet link; ComponentLink1URL: http://www.koaspeer.com/catimages/Products/RK73H/RK73H.pdf; Supplier 1: Mouser; Supplier Part Number 1: P10KDCCT-ND
R52 = CRCW0402130RJNED: RES, 130, 5%, 0.063 W, 0402; Manufacturer: Vishay-Dale; CompType: Resistor; Value: 130; Value_Code: 130R; Tolerance_%: 5; Power_W: 0.063; Value2: 0.063W; VDC_V: 50; TempCo: 200 ppm/C; SizeArea_mm2: 0.5; SizeX_mm: 1; SizeZ_mm: 0.6; EIA_Code: E24; U/M: EA; AEC Category: Q200; Green_Lifecycle: Active; Green_REACh: Passed; SymbolVersion: 2009-05-29; PartNumber: CRCW0402130RJNED; PackageReference: 0402; RoHS: Y; Res_ohm: 130; Value1: 5%; MountType: SMT; Technology: Thick Film; SizeY_mm: 0.5; Published: 2008-06-26; Publisher: Texas Instruments; LatestRevisionDate: 2017-06-12; ComponentLink1Description: Datasheet link; ComponentLink1URL: http://www.vishay.com/docs/20035/dcrcwe3.pdf; Supplier 1: Digi-Key; Supplier Part Number 1: 541-130JCT-ND; Supplier 2: Newark; Supplier Part Number 2: 89M6605; Supplier 3: Mouser; Supplier Part Number 3: 71-CRCW0402130RJNED; AEC Qualified: ?; Green_EU RoHS: Passed with Exemption; Green_EU RoHS-2: Passed
R57 = CRCW040212K4FKED: RES, 12.4 k, 1%, 0.063 W, 0402; Manufacturer: Vishay-Dale; CompType: Resistor; Value: 12.4k; Res_ohm: 12400; Value_Code: 12k4; Tolerance_%: 1; Power_W: 0.063; Value2: 0.063W; VDC_V: 50; TempCo: 100 ppm/C; SizeArea_mm2: 0.5; SizeZ_mm: 0.6; EIA_Code: E96; U/M: EA; AEC Category: Q200; Green_Lifecycle: Active; Green_REACh: Passed; SymbolVersion: 2009-05-29; PartNumber: CRCW040212K4FKED; PackageReference: 0402; RoHS: Y; Value1: 1%; MountType: SMT; Technology: Thick Film; SizeX_mm: 1; SizeY_mm: 0.5; Published: 2008-06-26; Publisher: Texas Instruments; LatestRevisionDate: 2017-06-12; ComponentLink1Description: Datasheet link; ComponentLink1URL: http://www.vishay.com/docs/20035/dcrcwe3.pdf; Supplier 1: Digi-Key; Supplier Part Number 1: 541-12.4KLCT-ND; Supplier 2: Newark; Supplier Part Number 2: 52K6648; Supplier 3: Mouser; Supplier Part Number 3: 71-CRCW0402-12.4K-E3; AEC Qualified: ?; Green_EU RoHS: Passed with Exemption; Green_EU RoHS-2: Passed
R59 = CMP-0026845-3: RES SMD 330 OHM 1% 1/10W 0402; Manufacturer: Panasonic Electronic Components; PartNumber: ERJ-2RKF3300X; Power_W: 63mW; TempCo: 200 ppm/C; Value_Code: 160R; Value1: 5%; Value: 160; EIA_Code: E24; SizeX_mm: 1; SizeY_mm: 0.5; SizeZ_mm: 0.6; Value2: 0.063W; AEC Qualified: Y; VDC_V: 50V; AEC Category: Q200; AEC Grade: 0; RoHS: E; MountType: SMT; PackageReference: 0402; Tolerance_%: 1%; Res_ohm: 160; SizeArea_mm2: 0.5; CompType: Resistor; ComponentLink1Description: Datasheet link; Technology: Thick Film; ComponentLink1URL: http://www.vishay.com/docs/20035/dcrcwe3.pdf
R60 R61 = CRCW0402383KFKED: RES, 383 k, 1%, 0.063 W, 0402; Manufacturer: Vishay-Dale; CompType: Resistor; Value: 383k; Res_ohm: 383000; Tolerance_%: 1; Power_W: 0.063; Value2: 0.063W; VDC_V: 50; TempCo: 100 ppm/C; SizeArea_mm2: 0.5; SizeZ_mm: 0.6; EIA_Code: E96; U/M: EA; AEC Category: Q200; Green_Lifecycle: Active; Green_REACh: Passed; SymbolVersion: 2009-05-29; PartNumber: CRCW0402383KFKED; PackageReference: 0402; RoHS: Y; Value_Code: 383k; Value1: 1%; MountType: SMT; Technology: Thick Film; SizeX_mm: 1; SizeY_mm: 0.5; Published: 2008-06-26; Publisher: Texas Instruments; LatestRevisionDate: 2017-06-12; ComponentLink1Description: Datasheet link; ComponentLink1URL: http://www.vishay.com/docs/20035/dcrcwe3.pdf; Supplier 1: Digi-Key; Supplier Part Number 1: 541-383KLCT-ND; Supplier 2: Newark; Supplier Part Number 2: 52K7024; Supplier 3: Mouser; Supplier Part Number 3: 71-CRCW0402-383K-E3; AEC Qualified: ?; Green_EU RoHS: Passed with Exemption; Green_EU RoHS-2: Passed
U4 U5 = CMP-0073970-1: 2.95V to 6V Input, 2A Synchronous Step-Down SWIFT(TM) Converter, RTE0016F (WQFN-16); Alternate PartNumber: TPS54218RTET; Alternate Manufacturer: Texas Instruments; Green_Lifecycle: Active; SizeAreaWB_mm2: 16.0; Green_REACh: Passed; U/M: EA; SizeZ_mm: 0.8; SizeX_mm: 3.0; SizeArea_mm2: 9.0; CompType: IC; ComponentLink1URL: http://www.ti.com/lit/ds/symlink/tps54218.pdf; Publisher: Texas Instruments; PackageDescription: WQFN-16; RoHS: Y; Footprint Path 6: C:\AltiumLibraries\Footprints\TI\.PcbLib; MountType: SMT; Green_EU RoHS-2: Passed; Manufacturer: Texas Instruments; Green_EU RoHS: Passed; PackageReference: RTE0016F; SizeY_mm: 3.0; LatestRevisionDate: 2017-06-09; PartNumber: TPS54218RTER; ComponentLink1Description: Datasheet Link

## Sheet LVPS RX Supply 1V8.SchDoc: LVPS RX Supply 1V8
size 431 x 279 mm; Date: Not shown in title block; ApprovedBy: Not shown in title block; CheckedBy: Not shown in title block; Author: Not shown in title block; CompanyName: Not shown in title block; DrawnBy: Abhishek Vishwa; Engineer: Not shown in title block; Organization: Not shown in title block; Address1: Not shown in title block; Address2: Not shown in title block; Address3: Not shown in title block; Address4: Not shown in title block; DocumentNumber: 1; Revision: Use project parameter SCH_Rev; SheetNumber: 9; SheetTotal: 12; PageSetup: Record=PageOptions|CenterHorizontal=True|CenterVertical=True|PrintScale=1.00|XCorrection=1.00|YCorrection=1.00|PrintKind=0|BorderSize=5000000|LeftOffset=0|BottomOffset=0|Orientation=2|PaperLength=1000|PaperWidth=1000|Scale=100|PaperSource=15|PrintQuality=600|MediaType=1|DitherType=10|PaperKind=Letter|PrintScaleMode=1; CurrentTime: Not shown in title block; CurrentDate: Not shown in title block; Time: Not shown in title block; DocumentFullPathAndName: Not shown in title block; DocumentName: Not shown in title block; ModifiedDate: Not shown in title block; ImagePath: Not shown in title block
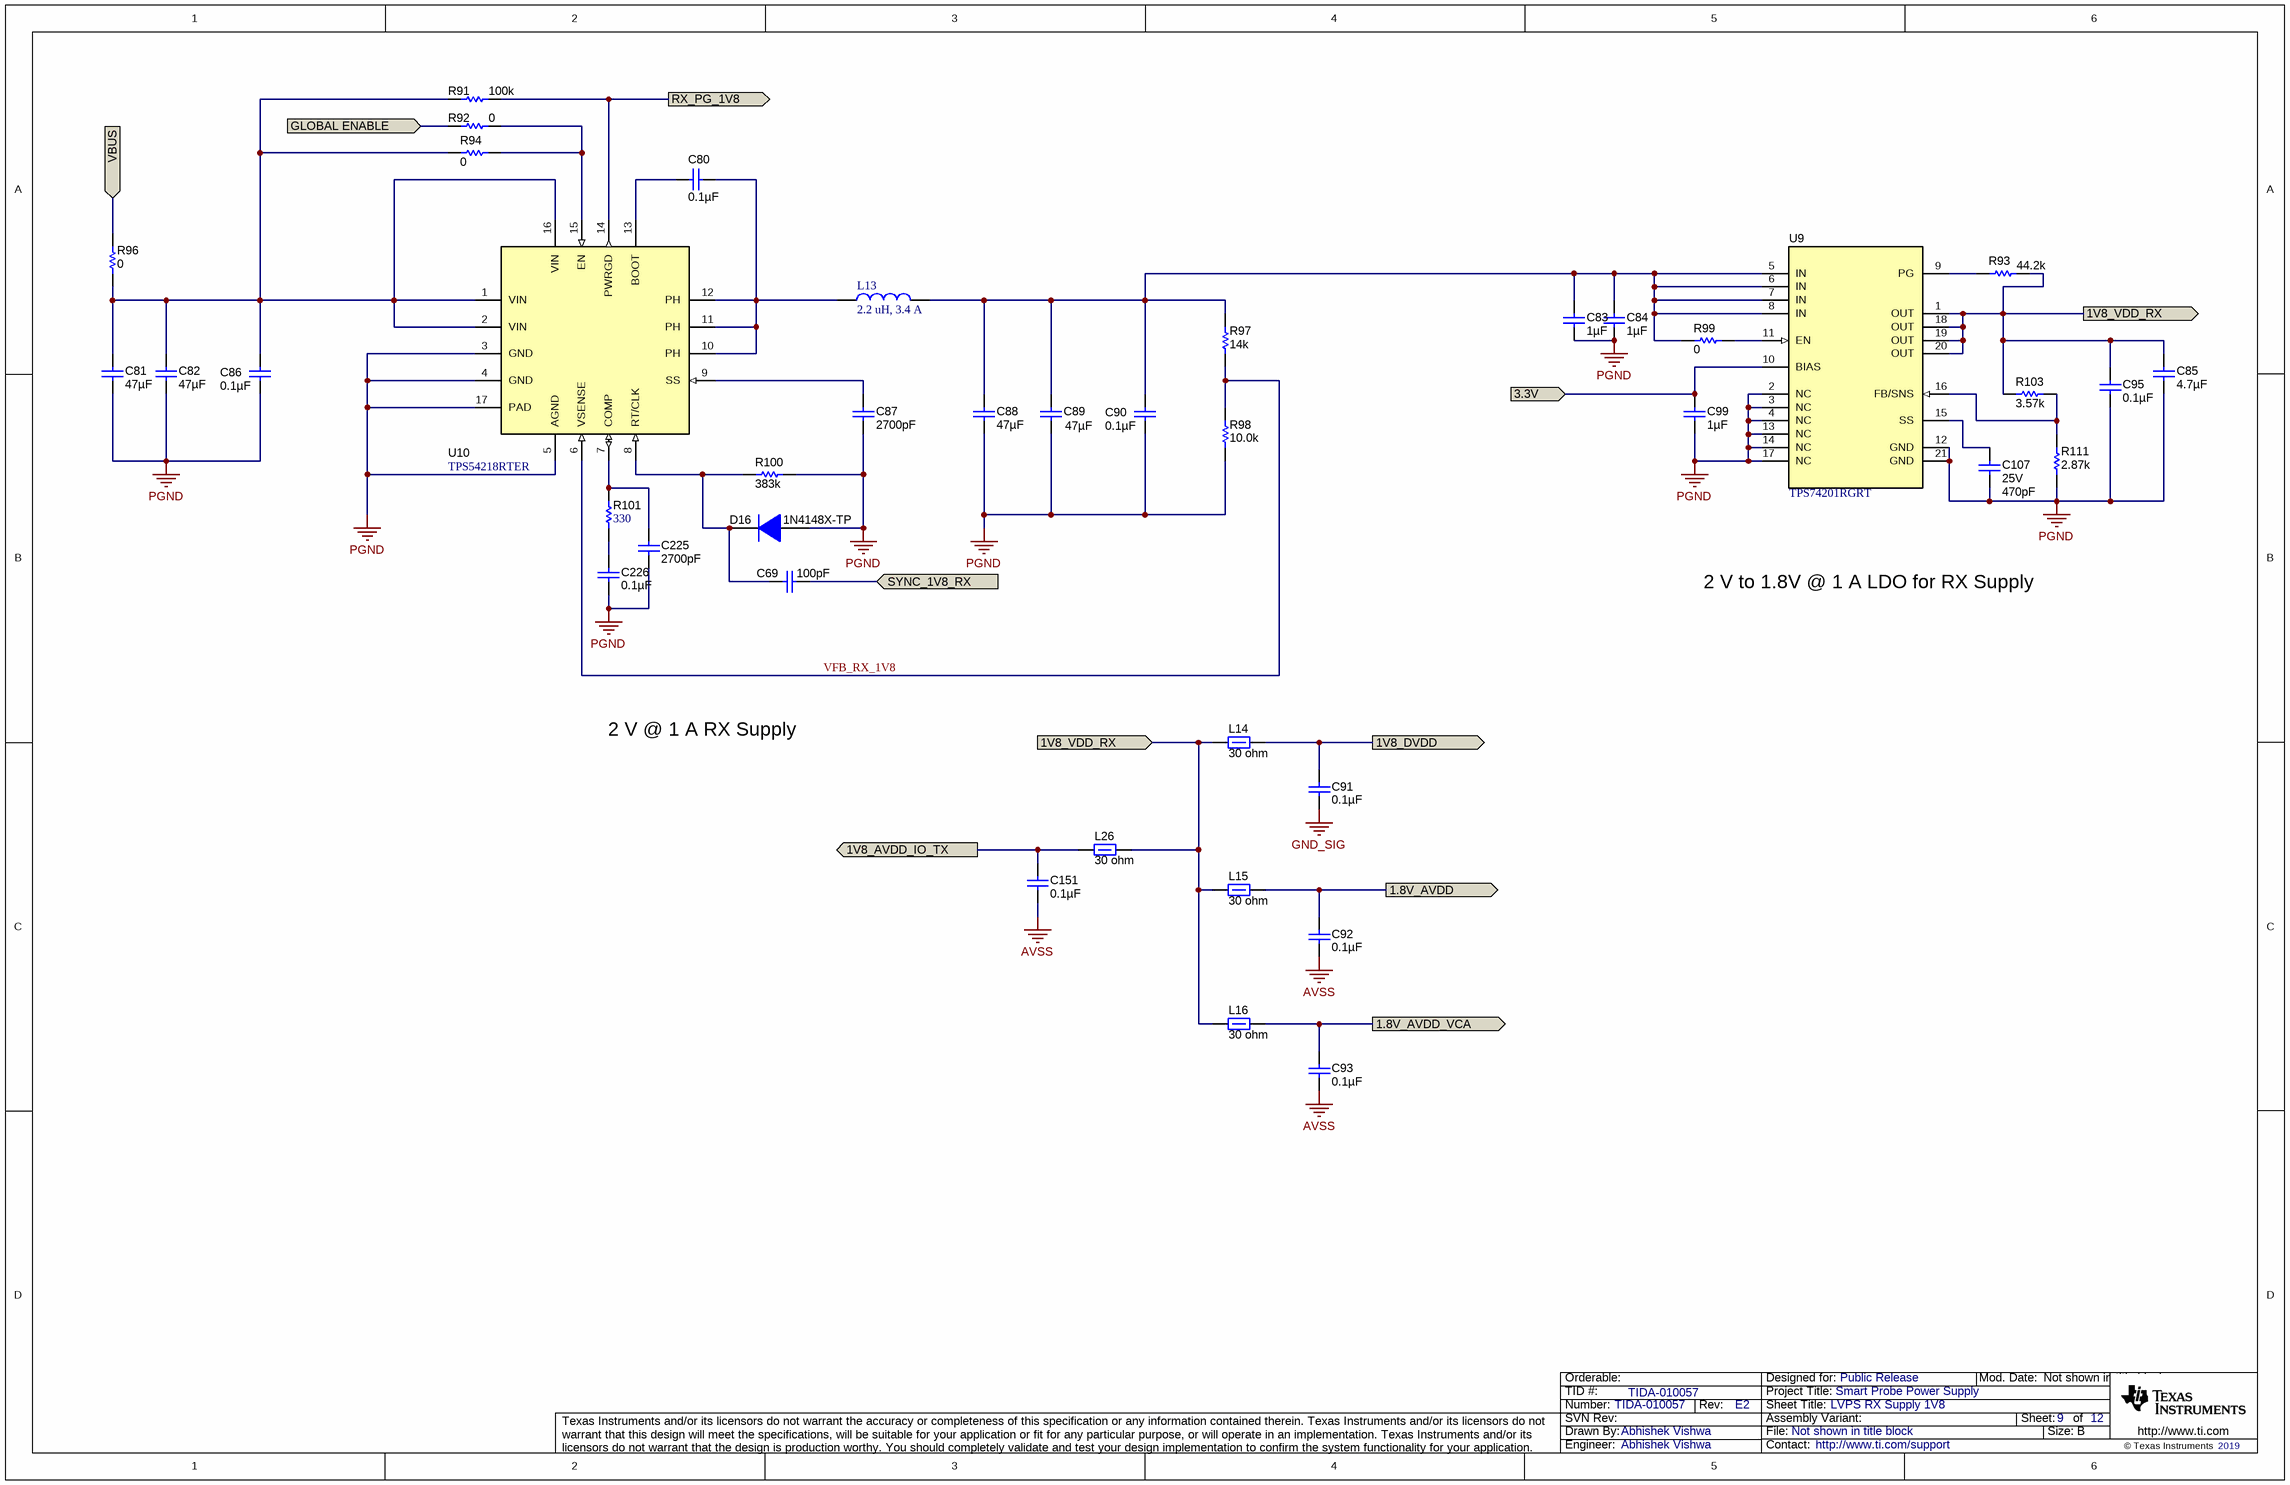
[diagram p4: LVPS RX Supply 1V8.SchDoc]

### Parts
C69  ValueDisplayed: 100pF  [0402]  (hidden comment: CL05C101JB5NNNC)
C80  ValueDisplayed: 0.1µF  [0603]  (hidden comment: 885012206095)
C81  ValueDisplayed: 47µF  [0805_HV]  (hidden comment: GRM219R60J476ME44D)
C82  ValueDisplayed: 47µF  [0805_HV]  (hidden comment: GRM219R60J476ME44D)
C83  ValueDisplayed: 1µF  [0603]  (hidden comment: 885012206052)
C84  ValueDisplayed: 1µF  [0603]  (hidden comment: 885012206052)
C85  ValueDisplayed: 4.7µF  [0603]  (hidden comment: GRM188R61A475MAAJ)
C86  ValueDisplayed: 0.1µF  [0603]  (hidden comment: 885012206095)
C87  ValueDisplayed: 2700pF  [0402]  (hidden comment: CL05B272KB5NNNC)
C88  ValueDisplayed: 47µF  [0603]  (hidden comment: GRM188R60J476ME15D)
C89  ValueDisplayed: 47µF  [0603]  (hidden comment: GRM188R60J476ME15D)
C90  ValueDisplayed: 0.1µF  [0603]  (hidden comment: 885012206095)
C91  ValueDisplayed: 0.1µF  [0402]  (hidden comment: GRM155R61E104KA87D)
C92  ValueDisplayed: 0.1µF  [0402]  (hidden comment: GRM155R61E104KA87D)
C93  ValueDisplayed: 0.1µF  [0402]  (hidden comment: GRM155R61E104KA87D)
C95  ValueDisplayed: 0.1µF  [0402]  (hidden comment: GRM155R61E104KA87D)
C99  ValueDisplayed: 1µF  [0603]  (hidden comment: 885012206052)
C107  VDC_V: 25V  ValueDisplayed: 470pF  [0402]  (hidden comment: GRM1555C1E471JA01D)
C151  ValueDisplayed: 0.1µF  [0402]  (hidden comment: GRM155R61E104KA87D)
C225  ValueDisplayed: 2700pF  [0402]  (hidden comment: CL05B272KB5NNNC)
C226  ValueDisplayed: 0.1µF  [0402]  (hidden comment: GRM155R61E104KA87D)
D16  1N4148X-TP  [SOD-523]
L13  2.2 uH, 3.4 A  [WE-TPC_6823]
L14  ValueDisplayed: 30 ohm  [0603]  (hidden comment: 742792609)
L15  ValueDisplayed: 30 ohm  [0603]  (hidden comment: 742792609)
L16  ValueDisplayed: 30 ohm  [0603]  (hidden comment: 742792609)
L26  ValueDisplayed: 30 ohm  [0603]  (hidden comment: 742792609)
R91  ValueDisplayed: 100k  [0402]  (hidden comment: CRCW0402100KJNED)
R92  ValueDisplayed: 0  [0402]  (hidden comment: ERJ-2GE0R00X)
R93  ValueDisplayed: 44.2k  [0402]  (hidden comment: CRCW040244K2FKED)
R94  ValueDisplayed: 0  [0402]  (hidden comment: ERJ-2GE0R00X)
R96  ValueDisplayed: 0  [0603]  (hidden comment: RMCF0603ZT0R00)
R97  ValueDisplayed: 14k  [0402]  (hidden comment: ERJ-2RKF1402X)
R98  ValueDisplayed: 10.0k  [0402]  (hidden comment: ERA-2AEB103X)
R99  ValueDisplayed: 0  [0402]  (hidden comment: ERJ-2GE0R00X)
R100  ValueDisplayed: 383k  [0402]  (hidden comment: CRCW0402383KFKED)
R101  ValueDisplayed: 330  [0402]  (hidden comment: CRCW0402160RJNED)
R103  ValueDisplayed: 3.57k  [0402]  (hidden comment: RC0402FR-073K57L)
R111  ValueDisplayed: 2.87k  [0402]  (hidden comment: CRCW04022K87FKED)
U9  TPS74201RGRT  [RGR0020A]
U10  TPS54218RTER  [RTE0016F]

### Ports
1.8V_AVDD (out), 1.8V_AVDD_VCA (out), 1V8_AVDD_IO_TX (out), 1V8_DVDD (out), 1V8_VDD_RX (in), 1V8_VDD_RX (out), 3.3V (in), GLOBAL ENABLE (in), RX_PG_1V8 (out), SYNC_1V8_RX (in), VBUS (in)

### Nets
AVSS: C92.1 C93.1 C151.1
GND_SIG: C91.1
PGND: C81.2 C82.2 C83.2 C84.2 C85.2 C86.2 C87.2 C88.2 C89.2 C90.2 C95.1 C99.2 C107.2 C225.2 C226.1 D16.2(A) R98.1 R100.2 R111.1 U9.2(NC) U9.3(NC) U9.4(NC) U9.12(GND) U9.13(NC) U9.14(NC) U9.17(NC) U9.21(GND) U10.3(GND) U10.4(GND) U10.5(AGND) U10.17(PAD)
1.8V_AVDD: C92.2 L15.2 ; port 1.8V_AVDD
1.8V_AVDD_VCA: C93.2 L16.2 ; port 1.8V_AVDD_VCA
1V8_AVDD_IO_TX: C151.2 L26.1 ; port 1V8_AVDD_IO_TX
1V8_DVDD: C91.2 L14.2 ; port 1V8_DVDD
1V8_VDD_RX: C85.1 C95.2 L14.1 L15.1 L16.1 L26.2 R93.2 R103.2 U9.1(OUT) U9.18(OUT) U9.19(OUT) U9.20(OUT) ; port 1V8_VDD_RX
3.3V: C99.1 U9.10(BIAS) ; port 3.3V
GLOBAL ENABLE: R92.1 ; port GLOBAL ENABLE
RX_PG_1V8: R91.2 U10.14(PWRGD) ; port RX_PG_1V8
SYNC_1V8_RX: C69.1 ; port SYNC_1V8_RX
VBUS: R96.2 ; port VBUS
VFB_RX_1V8: R97.1 R98.2 U10.6(VSENSE)
NetC69_2: C69.2 D16.1(K) R100.1 U10.8(RT/CLK)
NetC80_1: C80.1 U10.13(BOOT)
NetC80_2: C80.2 L13.1 U10.10(PH) U10.11(PH) U10.12(PH)
NetC81_1: C81.1 C82.1 C86.1 R91.1 R94.1 R96.1 U10.1(VIN) U10.2(VIN) U10.16(VIN)
NetC83_1: C83.1 C84.1 C88.1 C89.1 C90.1 L13.2 R97.2 R99.2 U9.5(IN) U9.6(IN) U9.7(IN) U9.8(IN)
NetC87_1: C87.1 U10.9(SS)
NetC107_1: C107.1 U9.15(SS)
NetC225_1: C225.1 R101.2 U10.7(COMP)
NetC226_2: C226.2 R101.1
NetR92_2: R92.2 R94.2 U10.15(EN)
NetR93_1: R93.1 U9.9(PG)
NetR99_1: R99.1 U9.11(EN)
NetR103_1: R103.1 R111.2 U9.16(FB/SNS)

### Notes on the sheet
- 2 V to 1.8V @ 1 A LDO for RX Supply
- 2 V @ 1 A RX Supply
- Drawn By:
- SVN Rev:
- Number:
- TID #:
- Orderable:
- Rev:
- Sheet Title:
- File:
- Project Title:
- Designed for:
- Assembly Variant:
- Mod. Date:
- Sheet:
- Size:
- of
- B
- http://www.ti.com
- Texas Instruments and/or its licensors do not warrant the accuracy or completeness of this specification or any information contained therein. Texas Instruments and/or its licensors do not warrant that this design will meet the specifications, will be suitable for your application or fit for any particular purpose, or will operate in an implementation. Texas Instruments and/or its licensors do not warrant that the design is production worthy. You should completely validate and test your design implementation to confirm the system functionality for your application.
- Engineer:
- Contact:
- © Texas Instruments

### Library data of the parts
C69 = 0402YC101KAT2A: as C239 on sheet LVPS_FX3_Supply; SymbolVersion: 2008-07-09; Value: 100pF; PartNumber: CL05C101JB5NNNC; PackageReference: 0402; RoHS: Y; MountType: SMT; Technology: Ceramic; Cap_Case: 0402; SizeY_mm: 0.5; Published: 2008-06-19; Publisher: Texas Instruments; LatestRevisionDate: 2017-06-22; ComponentLink1Description: Datasheet link; ComponentLink1URL: http://datasheets.avx.com/X7RDielectric.pdf; Supplier 1: Digi-Key; Supplier Part Number 1: 1276-1025-1-ND; Supplier 2: Newark; Supplier 3: Mouser; AEC Qualified: N; AEC Grade: N/A
C80 C86 C90 = 885012206095: as C39 on sheet LVPS_FX3_Supply; SymbolVersion: 2008-07-09; PartNumber: 885012206095; PackageReference: 0603; RoHS: Y; MountType: SMT; Technology: Ceramic; TempCo: X7R; Cap_Case: 0603; Published: 2008-06-19; Publisher: Texas Instruments; LatestRevisionDate: 2017-06-22; ComponentLink1Description: Datasheet link; ComponentLink1URL: http://katalog.we-online.de/pbs/datasheet/885012206095.pdf; AEC Qualified: N; AEC Grade: N/A; Green_EU RoHS: Passed; Green_EU RoHS-2: Incomplete
C81 C82 = GRM219R60J476ME44D: as C41 on sheet LVPS_FX3_Supply; SymbolVersion: 2008-07-09; PartNumber: GRM219R60J476ME44D; PackageReference: 0805; RoHS: Y; MountType: SMT; Technology: Ceramic; TempCo: X5R; Published: 2008-06-19; Publisher: Texas Instruments; LatestRevisionDate: 2017-06-22; ComponentLink1Description: Datasheet link; ComponentLink1URL: http://psearch.en.murata.com/capacitor/product/GRM219R60J476ME44%23.pdf; Supplier 1: Digi-Key; Supplier Part Number 1: 490-13249-1-ND; Supplier 2: Mouser; Supplier Part Number 2: 81-GRM219R60J476ME4D; AEC Qualified: N; AEC Grade: N/A; Green_EU RoHS: Passed; Green_EU RoHS-2: Incomplete
C83 C84 C99 = 885012206052: as C235 on sheet Input Output Connector; SymbolVersion: 2008-07-09; PartNumber: 885012206052; PackageReference: 0603; RoHS: Y; MountType: SMT; Technology: Ceramic; TempCo: X7R; Cap_Case: 0603; Published: 2008-06-19; Publisher: Texas Instruments; LatestRevisionDate: 2017-06-22; ComponentLink1Description: Datasheet link; ComponentLink1URL: http://katalog.we-online.de/pbs/datasheet/885012206052.pdf; Supplier 1: Mouser; Supplier Part Number 1: 710-885012206052; AEC Qualified: N; AEC Grade: N/A; Green_EU RoHS: Passed; Green_EU RoHS-2: Incomplete
C85 = GRM188R61A475MAAJ: as C234 on sheet Input Output Connector; SymbolVersion: 2008-07-09; PartNumber: GRM188R61A475MAAJ; PackageReference: 0603; RoHS: Y; MountType: SMT; Technology: Ceramic; TempCo: X5R; Cap_Case: 0603; Published: 2008-06-19; Publisher: Texas Instruments; LatestRevisionDate: 2017-06-22; ComponentLink1Description: Datasheet link; ComponentLink1URL: http://psearch.en.murata.com/capacitor/product/GRM188R61A475MAAJ%23.pdf; AEC Qualified: N; AEC Grade: N/A
C87 C225 = GRM155R71H272KA01D: as C45 on sheet LVPS_FX3_Supply; SymbolVersion: 2008-07-09; PartNumber: CL05B272KB5NNNC; PackageReference: 0402; RoHS: Y; MountType: SMT; Technology: Ceramic; TempCo: X7R; Cap_Case: 0402; SizeY_mm: 0.5; Published: 2008-06-19; Publisher: Texas Instruments; LatestRevisionDate: 2017-06-22; ComponentLink1Description: Datasheet link; ComponentLink1URL: http://search.murata.co.jp/Ceramy/PnsearchViewAction.do?HnOFG=ON&HnNFG=ON&SEL_CNT=50&sLang=en&sKey=GRM155R71H272KA01D&x=9&y=9&search=startwith; Supplier 1: Digi-Key; Supplier Part Number 1: 1276-1268-1-ND; Supplier 2: Mouser; AEC Qualified: ?
C88 C89 = GRM188R60J476ME15D: as C46 on sheet LVPS_FX3_Supply; SymbolVersion: 2008-07-09; PartNumber: GRM188R60J476ME15D; PackageReference: 0603; RoHS: Y; MountType: SMT; Technology: Ceramic; TempCo: X5R; Cap_Case: 0603; Published: 2008-06-19; Publisher: Texas Instruments; LatestRevisionDate: 2017-06-22; ComponentLink1Description: Datasheet link; ComponentLink1URL: http://psearch.en.murata.com/capacitor/product/GRM188R60J476ME15%23.pdf; AEC Qualified: ?; Green_EU RoHS: Passed; Green_EU RoHS-2: Incomplete
C91-C93 C95 C151 C226 = GRM155R61E104KA87D: as C165-C170 on sheet Input Output Connector; SymbolVersion: 2008-07-09; PartNumber: GRM155R61E104KA87D; PackageReference: 0402; RoHS: Y; MountType: SMT; Technology: Ceramic; TempCo: X5R; Cap_Case: 0402; SizeY_mm: 0.5; Published: 2008-06-19; Publisher: Texas Instruments; LatestRevisionDate: 2017-06-22; ComponentLink1Description: Datasheet link; ComponentLink1URL: http://psearch.murata.com/capacitor/product/GRM155R61E104KA87%23.pdf; Supplier 1: Digi-Key; Supplier Part Number 1: 490-5920-1-ND; Supplier 2: Mouser; Supplier Part Number 2: 81-GRM155R61E104KA7D; AEC Qualified: N; AEC Grade: N/A; Green_EU RoHS: Passed; Green_EU RoHS-2: Passed
C107 = CMP-0006389-2: CAP, CERM, 470 pF, 25 V, +/- 5%, C0G/NP0, 0402; Manufacturer: MuRata; TaMin_C: -55°C; Polarized: N; SizeAreaWB_mm2: 3; Value1: Unknown; U/M: EA; Value: 470pF; TaMax_C: 125°C; SizeZ_mm: 0.6; SizeX_mm: 1; SizeY_mm: 0.5; AEC Category: Q200; Supplier Part Number 2: 81-GRM1555C1E471JA1D; Publisher: Texas Instruments; Supplier 2: Mouser; TempCo: C0G/NP0; Published: 2008-06-19; RoHS: Y; MountType: SMT; Supplier 1: Digi-Key; PackageReference: 0402; Tolerance_%: 5%; Cap_Case: 0402; Value2: 25V; SizeArea_mm2: 0.5; CompType: Capacitor; LatestRevisionDate: 2017-03-09; PartNumber: GRM1555C1E471JA01D; AEC Qualified: ?; Cap_F: 470pF; ComponentLink1Description: Datasheet link; Supplier Part Number 1: GRM1555C1E471JA01D-ND; Technology: Ceramic; ComponentLink1URL: http://search.murata.co.jp/Ceramy/PnsearchViewAction.do?HnOFG=ON&HnNFG=ON&SEL_CNT=50&sLang=en&sKey=GRM1555C1E471JA01D&x=9&y=9&search=startwith
D16 = 1N4148X-TP: as D12 on sheet LVPS_FX3_Supply; SymbolVersion: 2008-12-08; PartNumber: 1N4148X-TP; PackageReference: SOD-523; CompType: Diode; MountType: SMT; Type: Switching; RoHS: Y; Published: 2008-06-26; Publisher: Texas Instruments; LatestRevisionDate: 2017-06-26; ComponentLink1Description: Datasheet link; ComponentLink1URL: http://www.mccsemi.com/up_pdf/1N4148X(SOD-523).PDF; Supplier 1: Digi-Key; Supplier Part Number 1: 1N4148XTPMSCT-ND; Supplier 2: Newark; Supplier Part Number 2: 69R6666; Supplier 3: Mouser; Supplier Part Number 3: 833-1N4148X-TP; AEC Qualified: ?; Green_EU RoHS: Incomplete; Green_EU RoHS-2: Incomplete
L13 = 744062002: SMT Shielded Tiny Power Inductor WE-TPC, size 6823, 2.2 uH, 3.4 A; Rated Current: 3.4 A; Inductance: 2.2 uH; DC Resistance max.: 24 mOhm; Self Resonant Frequency: 70 MHz; Saturation Current: 2.7 A; ComponentLink1Description: Manufacturer; ComponentLink1URL: http://www.we-online.de; ComponentLink2Description: Datasheet; ComponentLink2URL: https://katalog.we-online.com/pbs/datasheet/744062002.pdf; Part Number: 744062002; Published Date: December 2018; Publisher: Wurth Elektronik; Size: 6823; Operating Temperature: -40 to +125 degC; Mounting Technology: SMT; Packaging: Tape and Reel
L14-L16 L26 = 742792609: as L32 on sheet Input Output Connector; SymbolVersion: 2017-01-06; PartNumber: 742792609; CompType: Ferrite Bead; MountType: SMT; PackageReference: 0603; Published: 2014-04-30; Publisher: Texas Instruments; LatestRevisionDate: 2017-06-22; ComponentLink1Description: Datasheet link; ComponentLink1URL: http://katalog.we-online.de/pbs/datasheet/742792609.pdf; RoHS: Y; Supplier 1: Digi-Key; Supplier Part Number 1: 732-1591-1-ND; Supplier 2: Mouser; Supplier Part Number 2: 710-742792609; Green_EU RoHS: Passed; Green_EU RoHS-2: Incomplete
R91 = CRCW0402100KJNED: as R46 on sheet LVPS_FX3_Supply; SymbolVersion: 2009-05-29; PartNumber: CRCW0402100KJNED; PackageReference: 0402; RoHS: Y; Value_Code: 100k; Value1: 5%; MountType: SMT; Technology: Thick Film; SizeY_mm: 0.5; Published: 2008-06-26; Publisher: Texas Instruments; LatestRevisionDate: 2017-06-12; ComponentLink1Description: Datasheet link; ComponentLink1URL: http://www.vishay.com/docs/20035/dcrcwe3.pdf; Supplier 1: Digi-Key; Supplier Part Number 1: 541-100KJCT-ND; Supplier 2: Newark; Supplier Part Number 2: 59M6699; Supplier 3: Mouser; Supplier Part Number 3: 71-CRCW0402J-100K-E3; AEC Qualified: ?; Green_EU RoHS: Passed with Exemption; Green_EU RoHS-2: Passed
R92 R94 R99 = ERJ-2GE0R00X: as R25 on sheet Input Output Connector; SymbolVersion: 2009-05-29; PartNumber: ERJ-2GE0R00X; PackageReference: 0402; RoHS: Y; Res_ohm: 0; Value1: 5%; MountType: SMT; Technology: Thick Film; SizeY_mm: 0.5; Published: 2008-06-26; Publisher: Texas Instruments; LatestRevisionDate: 2017-06-12; ComponentLink1Description: Datasheet link; ComponentLink1URL: http://www.panasonic.com/industrial/components/pdf/AOA0000CE1.pdf; Supplier 1: Digi-Key; Supplier Part Number 1: P0.0JCT-ND; Supplier 2: Newark; Supplier Part Number 2: 65T8307; Supplier 3: Mouser; Supplier Part Number 3: 667-ERJ-2GE0R00X; AEC Qualified: ?; Green_EU RoHS: Passed with Exemption; Green_EU RoHS-2: Passed
R93 = CRCW040244K2FKED: RES, 44.2 k, 1%, 0.063 W, 0402; Manufacturer: Vishay-Dale; CompType: Resistor; Value: 44.2k; Res_ohm: 44200; Value_Code: 44k2; Tolerance_%: 1; Power_W: 0.063; Value2: 0.063W; VDC_V: 50; TempCo: 100 ppm/C; SizeArea_mm2: 0.5; SizeZ_mm: 0.6; EIA_Code: E96; U/M: EA; AEC Category: Q200; Green_Lifecycle: Active; Green_REACh: Passed; SymbolVersion: 2009-05-29; PartNumber: CRCW040244K2FKED; PackageReference: 0402; RoHS: Y; Value1: 1%; MountType: SMT; Technology: Thick Film; SizeX_mm: 1; SizeY_mm: 0.5; Published: 2008-06-26; Publisher: Texas Instruments; LatestRevisionDate: 2017-06-12; ComponentLink1Description: Datasheet link; ComponentLink1URL: http://www.vishay.com/docs/20035/dcrcwe3.pdf; Supplier 1: Digi-Key; Supplier Part Number 1: 541-44.2KLCT-ND; Supplier 2: Newark; Supplier Part Number 2: 52K7076; Supplier 3: Mouser; Supplier Part Number 3: 71-CRCW0402-44.2K-E3; AEC Qualified: ?; Green_EU RoHS: Passed with Exemption; Green_EU RoHS-2: Passed
R96 = RMCF0603ZT0R00: as R49 on sheet LVPS_FX3_Supply; SymbolVersion: 2009-05-29; PartNumber: RMCF0603ZT0R00; PackageReference: 0603; RoHS: Y; Res_ohm: 0; Value_Code: 0; Value1: 1%; MountType: SMT; Technology: Thick Film; SizeZ_mm: 1; Published: 2008-06-26; Publisher: Texas Instruments; LatestRevisionDate: 2017-06-13; ComponentLink1Description: Datasheet link; ComponentLink1URL: https://www.seielect.com/Catalog/SEI-RMCF_RMCP.pdf; Supplier 1: Digi-Key; Supplier Part Number 1: RMCF0603ZT0R00CT-ND; AEC Grade: 0; Green_EU RoHS: Passed with Exemption; Green_EU RoHS-2: Incomplete
R97 = ERJ-2RKF4991X: RES SMD 14K OHM 1% 1/10W 0402; Manufacturer: Panasonic; CompType: Resistor; Value: 4.99k; Res_ohm: 4990; Value_Code: 4k99; Tolerance_%: 1; Power_W: 0.1; Value2: 0.1W; VDC_V: 50; TempCo: 100 ppm/C; SizeArea_mm2: 0.5; SizeZ_mm: 0.6; EIA_Code: E96; U/M: EA; AEC Category: Q200; AEC Qualified: Y; AEC Grade: 0; Green_Lifecycle: Active; Green_REACh: Passed; SymbolVersion: 2009-05-29; PartNumber: ERJ-2RKF1402X; PackageReference: 0402; RoHS: Y; Value1: 1%; MountType: SMT; Technology: Thick Film; SizeX_mm: 1; SizeY_mm: 0.5; Published: 2008-06-26; Publisher: Texas Instruments; LatestRevisionDate: 2017-06-12; ComponentLink1Description: Datasheet link; ComponentLink1URL: http://industrial.panasonic.com/cdbs/www-data/pdf/RDA0000/AOA0000C86.pdf; Green_EU RoHS: Passed with Exemption; Green_EU RoHS-2: Passed
R98 = RK73H1ETTP1002F: as R51 on sheet LVPS_FX3_Supply; SymbolVersion: 2009-05-29; PartNumber: ERA-2AEB103X; PackageReference: 0402; RoHS: Y; Value1: 0.1%; MountType: SMT; Technology: Thick Film; SizeX_mm: 1; SizeY_mm: 0.5; Published: 2008-06-26; Publisher: Texas Instruments; LatestRevisionDate: 2017-06-12; ComponentLink1Description: Datasheet link; ComponentLink1URL: http://www.koaspeer.com/catimages/Products/RK73H/RK73H.pdf; Supplier 1: Mouser; Supplier Part Number 1: P10KDCCT-ND
R100 = CRCW0402383KFKED: as R60 on sheet LVPS_FX3_Supply; SymbolVersion: 2009-05-29; PartNumber: CRCW0402383KFKED; PackageReference: 0402; RoHS: Y; Value_Code: 383k; Value1: 1%; MountType: SMT; Technology: Thick Film; SizeX_mm: 1; SizeY_mm: 0.5; Published: 2008-06-26; Publisher: Texas Instruments; LatestRevisionDate: 2017-06-12; ComponentLink1Description: Datasheet link; ComponentLink1URL: http://www.vishay.com/docs/20035/dcrcwe3.pdf; Supplier 1: Digi-Key; Supplier Part Number 1: 541-383KLCT-ND; Supplier 2: Newark; Supplier Part Number 2: 52K7024; Supplier 3: Mouser; Supplier Part Number 3: 71-CRCW0402-383K-E3; AEC Qualified: ?; Green_EU RoHS: Passed with Exemption; Green_EU RoHS-2: Passed
R101 = CMP-0026845-3: as R59 on sheet LVPS_FX3_Supply; RoHS: E; MountType: SMT; PackageReference: 0402; Tolerance_%: 1%; Res_ohm: 160; SizeArea_mm2: 0.5; CompType: Resistor; ComponentLink1Description: Datasheet link; Technology: Thick Film; ComponentLink1URL: http://www.vishay.com/docs/20035/dcrcwe3.pdf
R103 = CMP-0078784-1: RES, 3.57 k, 1%, 0.063 W, 0402; Manufacturer: Yageo America; Value_Code: 3k57; SizeArea_mm2: 0.5; AEC Qualified: N; AEC Category: Q200; Value: 3.57k; SizeZ_mm: 0.6; EIA_Code: E96; TempCo: 100 ppm/C; Power_W: 63mW; VDC_V: 50V; Value2: 0.063W; SizeX_mm: 1; ComponentLink1Description: Datasheet link; RoHS: Y; Tolerance_%: 1%; Supplier 1: Digi-Key; PackageReference: 0402; Technology: Thick Film; Res_ohm: 3.57k; PartNumber: RC0402FR-073K57L; Supplier Part Number 2: 603-RC0402FR-073K57L; Supplier 2: Mouser; AEC Grade: N/A; SizeY_mm: 0.5; ComponentLink1URL: http://www.yageo.com/documents/recent/PYu-RC_Group_51_RoHS_L_8.pdf; Value1: 1%; CompType: Resistor; MountType: SMT; Supplier Part Number 1: YAG3150CT-ND
R111 = CMP-0026243-2: RES, 2.87 k, 1%, 0.063 W, AEC-Q200 Grade 0, 0402; Manufacturer: Panasonic Electronic Components; PartNumber: ERJ-2RKF2871X; Power_W: 63mW; TempCo: 100 ppm/C; Value_Code: 2k87; Value: 2.87k; EIA_Code: E96; SizeX_mm: 1; SizeY_mm: 0.5; SizeZ_mm: 0.6; Value2: 0.063W; AEC Qualified: Y; VDC_V: 50V; AEC Category: Q200; AEC Grade: 0; ComponentLink1URL: http://www.vishay.com/docs/20035/dcrcwe3.pdf; Supplier 2: Newark; Supplier 3: Mouser; RoHS: E; Value1: 1%; MountType: SMT; Supplier 1: Digi-Key; PackageReference: 0402; Tolerance_%: 1%; Res_ohm: 2.87k; SizeArea_mm2: 0.5; CompType: Resistor; ComponentLink1Description: Datasheet link; Supplier Part Number 1: P2.87KLCT-ND; Technology: Thick Film
U9 = CMP-0085416-1: Single Output LDO, 1.5A, Adj.(0.8 to 3.3V), Any or No Cap, Programmable Soft Start, RGR0020A (VQFN-20); Alternate Manufacturer: Texas Instruments; Alternate PartNumber: TPS74201RGRR; SizeX_mm: 3.5; SizeAreaWB_mm2: 20.25; CompType: IC; SizeArea_mm2: 12.25; AEC Category: Q200; Rating: Catalog; SizeZ_mm: 1; AEC Qualified: N; ComponentLink1Description: Datasheet Link; PackageDescription: VQFN-20; PackageReference: RGR0020A; MountType: SMT; ComponentLink1URL: http://www.ti.com/lit/ds/symlink/tps74201.pdf; ComponentLink3URL: http://www.ti.com/product/tps74201/datasheet; ComponentLink2URL: http://www.ti.com/product/tps74201; RoHS: Y; SizeY_mm: 3.5; Manufacturer: Texas Instruments; ComponentLink2Description: Product Folder; ComponentLink3Description: Online Datasheet; PartNumber: TPS74201RGRT; Operating Temperature Range: -40 to 125 C
U10 = CMP-0073970-1: as U4 on sheet LVPS_FX3_Supply; ComponentLink1URL: http://www.ti.com/lit/ds/symlink/tps54218.pdf; Publisher: Texas Instruments; PackageDescription: WQFN-16; RoHS: Y; Footprint Path 6: C:\AltiumLibraries\Footprints\TI\.PcbLib; MountType: SMT; Green_EU RoHS-2: Passed; Manufacturer: Texas Instruments; Green_EU RoHS: Passed; PackageReference: RTE0016F; SizeY_mm: 3.0; LatestRevisionDate: 2017-06-09; PartNumber: TPS54218RTER; ComponentLink1Description: Datasheet Link